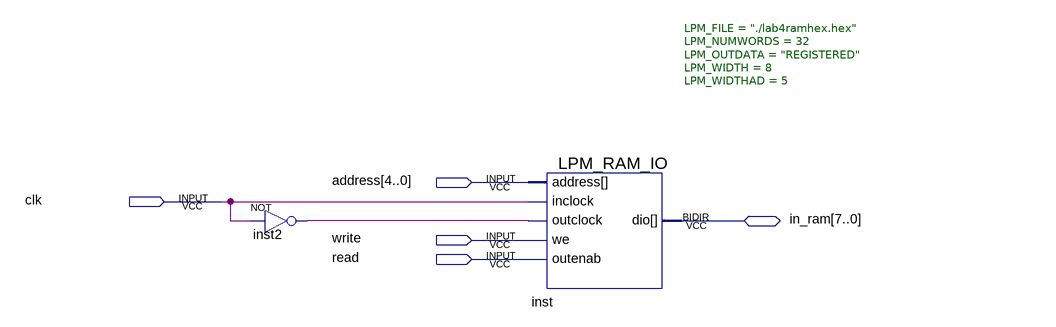
[diagram p0: schematic sheet]
// Quartus schematic RAM.bdf as structural Verilog: 2 symbols, 5 pins
module RAM (
  input  [4:0] address,
  input  clk,
  input  write,
  input  read,
  inout  [7:0] in_ram
);

  wire inst2_out;

  not inst2 (inst2_out, clk);
  LPM_RAM_IO #(.LPM_FILE("./lab4ramhex.hex"), .LPM_NUMWORDS(32), .LPM_OUTDATA("REGISTERED"), .LPM_WIDTH(8), .LPM_WIDTHAD(5)) inst (
    .address(address), .outclock(inst2_out), .inclock(clk), .we(write), .outenab(read), .dio(in_ram));
endmodule
